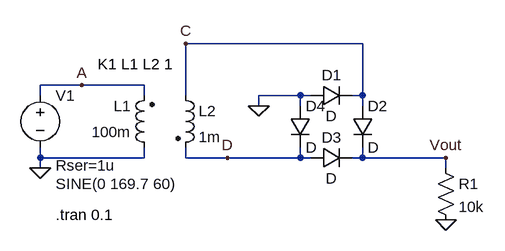
[diagram p0: schematic bridgeRect.asc]
bridgeRect.asc, the LTspice schematic file:
Version 4
SHEET 1 880 680
WIRE 576 80 304 80
WIRE 144 144 80 144
WIRE 240 144 144 144
WIRE 80 160 80 144
WIRE 240 160 240 144
WIRE 304 160 304 80
WIRE 480 160 416 160
WIRE 496 160 480 160
WIRE 576 160 576 80
WIRE 576 160 560 160
WIRE 416 176 416 160
WIRE 480 176 480 160
WIRE 576 176 576 160
WIRE 80 256 80 240
WIRE 240 256 240 240
WIRE 240 256 80 256
WIRE 304 256 304 240
WIRE 368 256 304 256
WIRE 480 256 480 240
WIRE 480 256 368 256
WIRE 496 256 480 256
WIRE 576 256 576 240
WIRE 576 256 560 256
WIRE 704 256 576 256
WIRE 80 272 80 256
WIRE 704 272 704 256
FLAG 416 176 0
FLAG 80 272 0
FLAG 704 352 0
FLAG 704 256 Vout
FLAG 304 80 C
FLAG 368 256 D
FLAG 144 144 A
SYMBOL voltage 80 144 R0
WINDOW 3 24 152 Left 2
WINDOW 123 0 0 Left 0
WINDOW 39 24 124 Left 2
SYMATTR InstName V1
SYMATTR Value SINE(0 169.7 60)
SYMATTR SpiceLine Rser=1u
SYMBOL ind2 256 256 R180
WINDOW 0 36 80 Left 2
WINDOW 3 36 40 Left 2
SYMATTR InstName L1
SYMATTR Value 100m
SYMATTR Type ind
SYMBOL ind2 288 144 R0
SYMATTR InstName L2
SYMATTR Value 1m
SYMATTR Type ind
SYMBOL res 688 256 R0
SYMATTR InstName R1
SYMATTR Value 10k
SYMBOL diode 496 176 R270
WINDOW 0 32 32 VTop 2
WINDOW 3 0 32 VBottom 2
SYMATTR InstName D1
SYMBOL diode 560 176 R0
SYMATTR InstName D2
SYMBOL diode 496 272 R270
WINDOW 0 32 32 VTop 2
WINDOW 3 0 32 VBottom 2
SYMATTR InstName D3
SYMBOL diode 464 176 R0
SYMATTR InstName D4
TEXT 104 344 Left 2 !.tran 0.1
TEXT 168 112 Left 2 !K1 L1 L2 1

The netlist it stands for:
* bridgeRect.asc
V1 A 0 SINE(0 169.7 60) Rser=1u
L1 0 A 100m
L2 C D 1m
R1 Vout 0 10k
D1 0 C D
D2 C Vout D
D3 D Vout D
D4 0 D D
.model D D
.lib standard.dio
.tran 0.1
K1 L1 L2 1
.backanno
.end

* Results of the author's LTspice run, read from the files saved beside the schematic
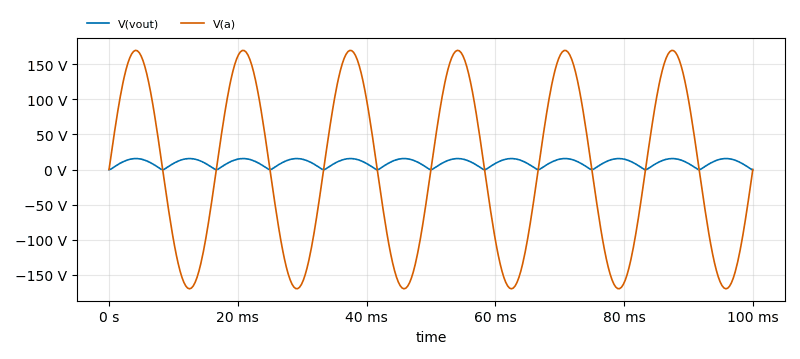
[diagram p1: Transient Analysis of bridgeRect.asc, plotted from the saved traces]
* Transient Analysis, 1 run:
*   V(vout): min 0 V, max 15.63 V, average 9.529 V, rms 10.82 V, last 0 V
*   V(a): min -169.7 V, max 169.6 V, average -302.5 µV, rms 119.9 V, last 0 V